# Altium schematic sheet Sheet1.SchDoc
size A4; SheetNumber: 1; SheetTotal: 1
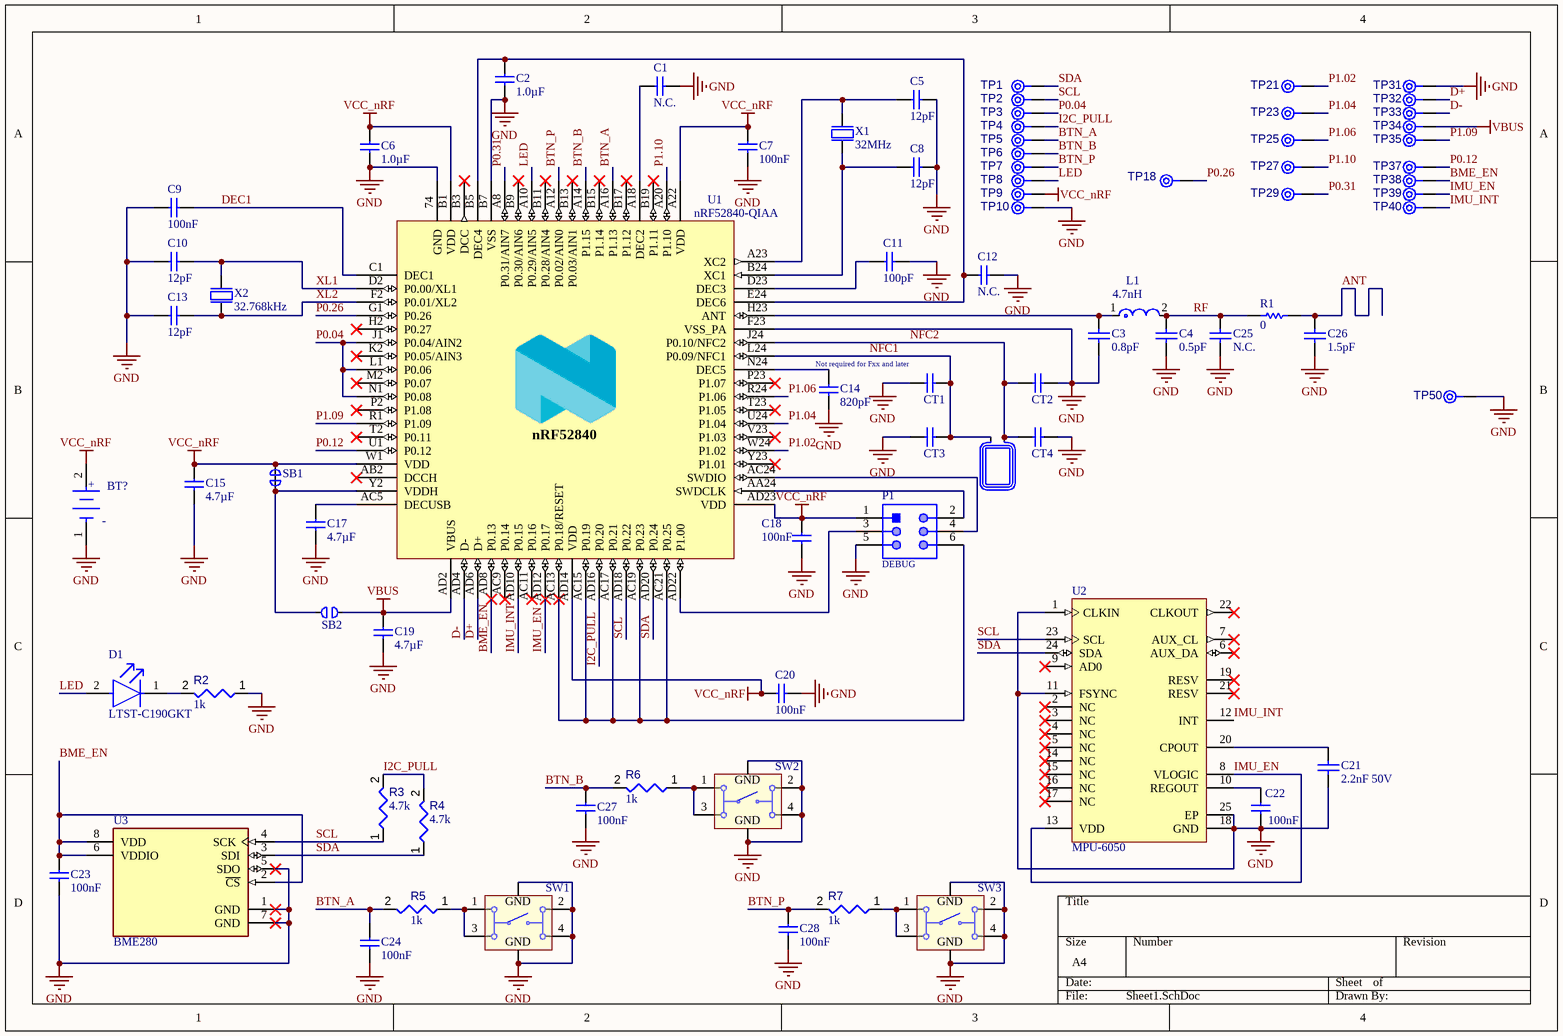
[diagram p0: Sheet1.SchDoc]

## Parts
A1  NFC Antenna  [TP_2x1mm_TH]  (value not drawn)  (no BOM)
BT?  BU2032SM-BT-GTR; BS-06-B4AK001  [FP-BU2032SM-BT-GTR-MFG]  (value not drawn)
C1  N.C.  [CAPC1005X04L]
C2  1.0µF  [CAPC1608X06L]
C3  0.8pF  [CAPC0603X28X15NL05T05]
C4  0.5pF  [CAPC0603X28X15NL05T05]
C5  12pF  [CAPC1005X04L]
C6  1.0µF  [CAPC1608X06L]
C7  100nF  [CAPC1005X04L]
C8  12pF  [CAPC1005X04L]
C9  100nF  [CAPC1005X04L]
C10  12pF  [CAPC1005X04L]
C11  100pF  [CAPC1005X04L]
C12  N.C.  [CAPC1005X04L]
C13  12pF  [CAPC1005X04L]
C14  820pF  Assembly: Not required for Fxx and later  [CAPC1005X04L]
C15  4.7µF  [CAPC1608X06L]
C17  4.7µF  [CAPC1608X06L]
C18  100nF  [CAPC1005X04L]
C19  4.7µF  [CAPC1608X06L]
C20  100nF  [CAPC1005X04L]
C21  2.2nF 50V  [CAPC1608X90X35NL10T15]
C22  100nF  [CAPC1005X04L]
C23  100nF  [CAPC1005X04L]
C24  100nF  [CAPC1005X04L]
C25  N.C.  [CAPC0603X33X15NL03T05]
C26  1.5pF  [CAPC0603X33X15NL03T05]
C27  100nF  [CAPC1005X04L]
C28  100nF  [CAPC1005X04L]
CT1  Antenna dependent  [CAPC1005X04L]  (value not drawn)
CT2  Antenna dependent  [CAPC1005X04L]  (value not drawn)
CT3  Antenna dependent  [CAPC1005X04L]  (value not drawn)
CT4  Antenna dependent  [CAPC1005X04L]  (value not drawn)
D1  LTST-C190GKT  [FP-LTST-C190GKT-MFG]
L1  4.7nH  [FP-LQP03TG_02-IPC_B]
P1  DEBUG  [61000621121]
R1  0  [RESC0603X26X15LL03T05]
R2  value 1k  [RESC0402(1005)_L]  (hidden comment: Resistor 1K +/-5 % 0402 63 mW)
R3  value 4.7k  [RESC1608X55X25ML10T15]  (hidden comment: Resistor 4k7 +/-1% 0603 100 mW)
R4  value 4.7k  [RESC1608X55X25ML10T15]  (hidden comment: Resistor 4k7 +/-1% 0603 100 mW)
R5  value 1k  [RESC0402(1005)_L]  (hidden comment: Resistor 1K +/-5 % 0402 63 mW)
R6  value 1k  [RESC0402(1005)_L]  (hidden comment: Resistor 1K +/-5 % 0402 63 mW)
R7  value 1k  [RESC0402(1005)_L]  (hidden comment: Resistor 1K +/-5 % 0402 63 mW)
SB1  Copy of Solder Bridge connected  [CAPC1005X06N]  (value not drawn)  (net tie, no BOM)
SB2  Solder Bridge not connected  [CAPC1005X06N]  (value not drawn)
SW1  431181015816  [431181015816]  (value not drawn)
SW2  431181015816  [431181015816]  (value not drawn)
SW3  431181015816  [431181015816]  (value not drawn)
TP1  TPAD6R  [TP06R]  (value not drawn)  (no BOM)
TP2  TPAD6R  [TP06R]  (value not drawn)  (no BOM)
TP3  TPAD6R  [TP06R]  (value not drawn)  (no BOM)
TP4  TPAD6R  [TP06R]  (value not drawn)  (no BOM)
TP5  TPAD6R  [TP06R]  (value not drawn)  (no BOM)
TP6  TPAD6R  [TP06R]  (value not drawn)  (no BOM)
TP7  TPAD6R  [TP06R]  (value not drawn)  (no BOM)
TP8  TPAD6R  [TP06R]  (value not drawn)  (no BOM)
TP9  TPAD6R  [TP06R]  (value not drawn)  (no BOM)
TP10  TPAD6R  [TP06R]  (value not drawn)  (no BOM)
TP18  TPAD6R  [TP06R]  (value not drawn)  (no BOM)
TP21  TPAD6R  [TP06R]  (value not drawn)  (no BOM)
TP23  TPAD6R  [TP06R]  (value not drawn)  (no BOM)
TP25  TPAD6R  [TP06R]  (value not drawn)  (no BOM)
TP27  TPAD6R  [TP06R]  (value not drawn)  (no BOM)
TP29  TPAD6R  [TP06R]  (value not drawn)  (no BOM)
TP31  TPAD6R  [TP06R]  (value not drawn)  (no BOM)
TP32  TPAD6R  [TP06R]  (value not drawn)  (no BOM)
TP33  TPAD6R  [TP06R]  (value not drawn)  (no BOM)
TP34  TPAD6R  [TP06R]  (value not drawn)  (no BOM)
TP35  TPAD6R  [TP06R]  (value not drawn)  (no BOM)
TP37  TPAD6R  [TP06R]  (value not drawn)  (no BOM)
TP38  TPAD6R  [TP06R]  (value not drawn)  (no BOM)
TP39  TPAD6R  [TP06R]  (value not drawn)  (no BOM)
TP40  TPAD6R  [TP06R]  (value not drawn)  (no BOM)
TP50  TPAD6R  [TP06R]  (value not drawn)  (no BOM)
U1  nRF52840-QIAA  [AQFN50P700X700X85_HS-74N]
U2  MPU-6050  [IS-QFN-24_V]
U3  BME280  [FP-BME280-MFG]
X1  32MHz  [BT-XTAL_2016]
X2  32.768kHz  [XTAL_3215]

## Nets
GND: BT?.1(C) C1.2 C2.1 C3.1 C4.1 C5.2 C6.1 C7.1 C8.2 C9.2 C10.1 C11.2 C12.1 C13.1 C14.1 C15.1 C17.1 C18.1 C19.1 C20.1 C21.1 C22.1 C23.2 C24.1 C25.1 C26.1 C27.1 C28.1 CT1.2 CT2.1 CT3.2 CT4.1 P1.5 R2.1 SW1.2 SW1.4 SW1.5 SW1.6 SW2.2 SW2.4 SW2.5 SW2.6 SW3.2 SW3.4 SW3.5 SW3.6 TP10.1(TP) TP31.1(TP) TP50.1(TP) U1.74(GND) U1.B7(VSS) U1.F23(VSS_PA) U2.1(CLKIN) U2.11(FSYNC) U2.18(GND) U2.25(EP) U3.1(GND) U3.5(SDO) U3.7(GND) X1.2(GND) X1.4(GND)
VBUS: C19.2 SB2.1 TP34.1(TP) U1.AD2(VBUS)
VCC_nRF: BT?.2(A) C6.2 C7.2 C15.2 C18.2 C20.2 P1.1 SB1.2 TP9.1(TP) U1.A22(VDD) U1.AD14(VDD) U1.AD23(VDD) U1.B1(VDD) U1.W1(VDD)
ANT: C26.2 R1.2
BME_EN: C23.1 TP38.1(TP) U1.AD8(P0.13) U3.2(~{CS}) U3.6(VDDIO) U3.8(VDD)
BTN_A: C24.2 R5.2 TP5.1(TP) U1.A16(P1.13)
BTN_B: C27.2 R6.2 TP6.1(TP) U1.A14(P1.15)
BTN_P: C28.2 R7.2 TP7.1(TP) U1.A12(P0.02/AIN0)
D+: TP32.1(TP) U1.AD6(D+)
D-: TP33.1(TP) U1.AD4(D-)
DEC1: C9.1 U1.C1(DEC1)
I2C_PULL: R3.2 R4.2 TP4.1(TP) U1.AD16(P0.20)
IMU_EN: TP39.1(TP) U1.AD12(P0.17) U2.8(VLOGIC) U2.13(VDD)
IMU_INT: TP40.1(TP) U1.AD10(P0.15) U2.12(INT)
LED: D1.2(A) TP8.1(TP) U1.A10(P0.29/AIN5)
NFC1: A1.2 CT1.1 CT3.1 U1.L24(P0.09/NFC1)
NFC2: A1.1 CT2.2 CT4.2 U1.J24(P0.10/NFC2)
P0.04: TP3.1(TP) U1.J1(P0.04/AIN2) U1.L1(P0.06) U1.N1(P0.08)
P0.12: TP37.1(TP) U1.U1(P0.12)
P0.26: TP18.1(TP) U1.G1(P0.26)
P0.31: TP29.1(TP) U1.A8(P0.31/AIN7)
P1.02: TP21.1(TP) U1.W24(P1.02)
P1.04: TP23.1(TP) U1.U24(P1.04)
P1.06: TP25.1(TP) U1.R24(P1.06)
P1.09: TP35.1(TP) U1.R1(P1.09)
P1.10: TP27.1(TP) U1.A20(P1.10)
RF: C4.2 C25.2 L1.2 R1.1
SCL: R3.1 TP2.1(TP) U1.AD18(P0.22) U2.23(SCL) U3.4(SCK)
SDA: R4.1 TP1.1(TP) U1.AD20(P0.24) U2.24(SDA) U3.3(SDI)
XL1: C10.2 U1.D2(P0.00/XL1) X2.2(out)
XL2: C13.2 U1.F2(P0.01/XL2) X2.1(inp)
NetC1_1: C1.1 U1.A18(DEC2)
NetC2_2: C2.2 C12.2 U1.B5(DEC4) U1.E24(DEC6)
NetC3_2: C3.2 L1.1 U1.H23(ANT)
NetC5_1: C5.1 U1.A23(XC2) X1.3(out)
NetC8_1: C8.1 U1.B24(XC1) X1.1(inp)
NetC11_1: C11.1 U1.D23(DEC3)
NetC14_2: C14.2 U1.N24(DEC5)
NetC17_2: C17.2 U1.AC5(DECUSB)
NetC21_2: C21.2 U2.20(CPOUT)
NetC22_2: C22.2 U2.10(REGOUT)
NetD1_1: D1.1(C) R2.2
NetP1_2: P1.2 U1.AA24(SWDCLK)
NetP1_3: P1.3 U1.AD22(P1.00)
NetP1_4: P1.4 U1.AC24(SWDIO)
NetP1_6: P1.6 U1.AC13(P0.18/RESET) U1.AC15(P0.19) U1.AC17(P0.21) U1.AC19(P0.23) U1.AC21(P0.25)
NetR5_1: R5.1 SW1.1 SW1.3
NetR6_1: R6.1 SW2.1 SW2.3
NetR7_1: R7.1 SW3.1 SW3.3
NetSB1_1: SB1.1 SB2.2 U1.Y2(VDDH)

Not connected (* = marked no-connect by the designer): U1 AB2(DCCH)* AC9(P0.14)* AC11(P0.16)* B3(DCC)* B9(P0.30/AIN6)* B11(P0.28/AIN4)* B13(P0.03/AIN1)* B15(P1.14)* B17(P1.12)* B19(P1.11)* H2(P0.27)* K2(P0.05/AIN3)* M2(P0.07)* P2(P1.08)* P23(P1.07)* T2(P0.11)* T23(P1.05)* V23(P1.03)* Y23(P1.01)*; U2 2(NC)* 3(NC)* 4(NC)* 5(NC)* 6(AUX_DA)* 7(AUX_CL)* 9(AD0)* 14(NC)* 15(NC)* 16(NC)* 17(NC)* 19(RESV)* 21(RESV)* 22(CLKOUT)*

## Notes on the sheet
- (in symbol CMP-1457-00006-1) GND
- (in symbol CMP-136216-000002-1) +; -
- (in symbol nRF52840-QIAA) nRF52840

## Library data of the parts
A1 = NFC_ANT_TP: Pad Count: 2; Part Number: NFC_ANT_TP; Footprint Doc: TP_2x1mm_TH; LatestRevisionDate: 2016-02-23; Published: 2016-02-23; Value: NFC Antenna
BT? = CMP-136216-000002-1: BATTERY HOLDER COIN 20MM SMD; Number of Cells: 1; Termination: SMD/SMT; Mount: Surface Mount; Max Operating Temperature: 280°C; Min Operating Temperature: -40°C; Package Quantity: 400; Case/Package: SMD/SMT
C1 C12 = C0402-N.C.: Not mounted; Pad Count: 2; Assembly: Not mounted; Part Number: C0402-N.C.; LatestRevisionDate: 2009-05-08; Published: 2009-05-08; Value: N.C.; Footprint Doc: 0402
C2 C6 = C0603-1µ0: Capacitor, X7R, ±10%; Pad Count: 2; Part Number: C0603-1µ0; LatestRevisionDate: 2013-06-05; Published: 2009-05-08; Value: 1.0µF; Footprint Doc: 0603
C3 = CMP-2010-00088-1: 02013J0R8PBWTR; Manufacturer: AVX Interconnect / Elco; Part Number: 02013J0R8PBWTR
C4 = CMP-2010-00076-1: 02013J0R5PBSTR; Manufacturer: AVX Interconnect / Elco; Part Number: 02013J0R5PBSTR
C5 C8 C10 C13 = C0402-12p: Capacitor, NP0, ±2%; Pad Count: 2; Part Number: C0402-12p; LatestRevisionDate: 2011-05-11; Published: 2009-05-08; Value: 12pF; Footprint Doc: 0402
C7 C9 C18 C20 C22-C24 C27 C28 = C0402-100n: Capacitor, X7R, ±10%; Pad Count: 2; Part Number: C0402-100n; LatestRevisionDate: 2009-11-23; Published: 2009-05-08; Value: 100nF; Footprint Doc: 0402
C11 = C0402-100p: Capacitor, NP0, ±5%; Pad Count: 2; Part Number: C0402-100p; LatestRevisionDate: 2009-05-08; Published: 2009-05-08; Value: 100pF; Footprint Doc: 0402
C14 = C0402-820p: Capacitor, NP0, ±5%; Pad Count: 2; Part Number: C0402-820p; LatestRevisionDate: 2009-05-08; Published: 2009-05-08; Value: 820pF; Footprint Doc: 0402
C15 C17 C19 = C0603-4µ7-10V-X7S: Capacitor, X7S, ±10%; Pad Count: 2; Part Number: C0603-4µ7-10V-X7S; LatestRevisionDate: 2016-08-15; Published: 2016-08-15; Value: 4.7µF; Footprint Doc: 0603
C21 = CMP-2006-02908-5: Chip Capacitor, 2.2 nF, +/- 10%, 50 V, -55 to 125 degC, 0603 (1608 Metric), RoHS, Tape and Reel; Manufacturer: Murata; Pins: 2; Mount: Surface Mount; Max Operating Temperature: 125 degC; ComponentLink1Description: Manufacturer URL; RoHSCompliant: true; PackageDescription: 2-Pin Surface Mount Device, Body 1.6 x 0.8 mm; ComponentLink2URL: http://search.murata.co.jp/Ceramy/image/img/A01X/G101/ENG/GRM188R71H222KA01-01.pdf; PackageReference: 0603; Height: 0.8 mm; Lead Pitch: 4 mm; Packaging: Tape and Reel; DatasheetVersion: 02/2016; Mounting Technology: Surface Mount; ComponentLink2Description: Datasheet; Min Operating Temperature: -55 degC; Voltage Rating: 50 V; Length: 1.6 mm; REACH SVHC: No SVHC; Package Quantity: 4000; ComponentLink1URL: http://www.murata.com/
C25 C26 = CMP-1033-00061-2: Part Number: 02013A1R5CAT2A; Manufacturer: AVX Interconnect / Elco
CT1-CT4 = C0402-TBD: Capacitor, NP0, ±5%; Pad Count: 2; Part Number: C0402-TBD; Footprint Doc: 0402; LatestRevisionDate: 2010-12-21; Published: 2010-12-21; Value: Antenna dependent
D1 = CMP-22017-000005-2: LED GREEN CLEAR CHIP SMD; Dominant Wavelength: 569nm; Reverse Voltage: 5V; Lens Color: Colorless; Viewing Angle: 130°; Voltage: 2V; Forward Current: 30mA; Power Dissipation: 100mW; Luminous Intensity: 6mcd; Number of LEDs: 1; Forward Voltage: 2.1V; Wavelength: 565nm; Test Current: 10mA; Min Operating Temperature: -55°C; Lens Style: Clear; Mount: Surface Mount; Width: 0.8mm; Packaging: Tape and Reel; Lens Transparency: Clear; Case Code (Metric): 1608; Depth: 0.8mm; Case Code (Imperial): 0603; Case/Package: 0603; Number of Pins: 2; Max Operating Temperature: 85°C; Lead Free: Lead Free; Number of Elements: 1; Length: 1.6mm; Height: 0.8mm; Package Quantity: 1; Power Rating: 100mW; Radiation Hardening: No; Illumination Color: Green; Color: Green
L1 = CMP-006-00021-1: Inductor RF Chip Thin Film 4.3nH 3% 500MHz 14Q-Factor 350mA 400mOhm DCR 0201 Paper T/R
P1 = CMP-1502-01024-1: SMT Vertical Pin Header WR-PHD, Pitch 2.54 mm, Dual Row, 6 pins; Manufacturer: Wurth Elektronik; Withstanding Voltage: 500VAC; Contact Resistance: 20mOhm; Working Voltage: 250VAC; Gender: Male; Rated Current: 3A; Pin Number: 6; Pitch: 2.54mm; Part Number: 61000621121; Operating Temperature: -40to125degC; Mounting Technology: SMT; Packaging: Tube; Datasheet URL: https://katalog.we-online.de/em/datasheet/6100xx21121.pdf; Package Reference: 61000621121; Publisher: WurthElektronik; Row Number: Dual; Orientation: Vertical; Manufacturer URL: http://www.we-online.de
R1 = CMP-2004-02624-1: ERJ-1GE0R00C; Manufacturer: Panasonic; Part Number: ERJ-1GE0R00C
R2 R5-R7 = CMP-009-00157-3: Chip Resistor, 1 kOhms, +/-5 %, 63 mW, -55 to 155 degC, 0402; Tolerance: 5%; Power: 63mW; Case/Package: 0402; Pins: 2; Min Operating Temperature: -55°C; Max Operating Temperature: 155°C
R3 R4 = CMP-009-00031-5: Chip Resistor, 4.7 KOhm, +/- 1%, 0.1 W, -55 to 155 degC, 0603 (1608 Metric); Power: 100mW; Tolerance: 1%; Mounting Technology: SM; Case/Package: 0603; RoHS Compliant: True; Pins: 2; Min Operating Temperature: -55°C; Max Operating Temperature: 155°C
SB1 = CMP-001-0001-5: Solder Bridge Jumper connected
SB2 = CMP-001-0000-3: Solder Bridge Jumper not connected
SW1-SW3 = CMP-1457-00006-1: WS-TASV SMD Tact Switch 5X5 mm with ground terminal; Manufacturer: Wuerth Elektronik; NoPins: 04; ComponentLink2URL: http://katalog.we-online.de/em/datasheet/431181015816.pdf; ComponentLink1URL: http://www.we-online.com; PackageReference: 431181015816; ComponentLink1Description: Manufacturer URL; ComponentLink2Description: Datasheet; PartNumber: 431181015816
TP1-TP10 TP18 TP21 TP23 TP25 TP27 TP29 TP31-TP35 TP37-TP40 TP50 = CMP-00028-00002-4: 0.6mm round; Pins: 1
U1 = nRF52840-QIAA: Multi-protocol Bluetooth Low Energy, IEEE 802.15.4, ANT and 2.4GHz proprietary system-on-chip; Pad Count: 73; Part Number: nRF52840-QIAA; LatestRevisionDate: 2017-08-21; Published: 2017-08-21; Value: nRF52840-QIAA; Footprint Doc: AQFN-73
U2 = CMP-1753-00002-2: 3-Axis Gyroscope, Accelerometer and a Digital Motion Processor(TM) (DMP), 2.375 to 3.46 V, -40 to 85 degC, 24-Pin QFN, RoHS, Tape and Reel; Manufacturer: InvenSense; Featured Product: MPU-60506-Axis,IntegratedI²CSolution; Other Names: 1428-1007-2 / MPU6050; Sensor Type: MotionTracking; Online Catalog: MPU-6000™Series; Unit PriceUSD: Digital; Datasheet Version: Rev. 3.3, 05/2012; Category: Sensors,Transducers; Datasheet URL: http://datasheet.octopart.com/MPU-6050-InvenSense-datasheet-14421344.pdf; Family: Multifunction; Standard Package: 5,000; Manufacturer URL: http://www.invensense.com/; Output Type: Digital; Dynamic Catalog: MPU-6000™Series
U3 = CMP-2000-05073-3: SENSOR PRESSURE HUMIDITY TEMP; Sensor Type: Temperature; Accuracy: 3%; Response Time: 1s; Output Type: SPI; Min Operating Temperature: -40°C; Max Operating Temperature: 85°C; Case/Package: LGA; Packaging: Cut Tape; Mount: Surface Mount; Lead Free: Lead Free; Number of Pins: 8
X1 = XTAL_SMD2016_32MHz_8pF_General: XTAL SMD 2016, 32MHz, Cl=8pF, Total Tol: ±40ppm; Pad Count: 4; Part Number: XTAL_SMD2016_32MHz_8pF_General; LatestRevisionDate: 2016-08-19; Published: 2016-08-19; Value: 32MHz; Footprint Doc: XTAL_2016
X2 = XTAL_SMD3215_32.768kHz_9pF_General: XTAL SMD 3215, 32.768kHz, Cl=9pF, Total Tol: ±50ppm; Pad Count: 2; Part Number: XTAL_SMD3215_32.768kHz_9pF_General; LatestRevisionDate: 2016-08-19; Published: 2016-08-19; Value: 32.768kHz; Footprint Doc: XTAL_3215